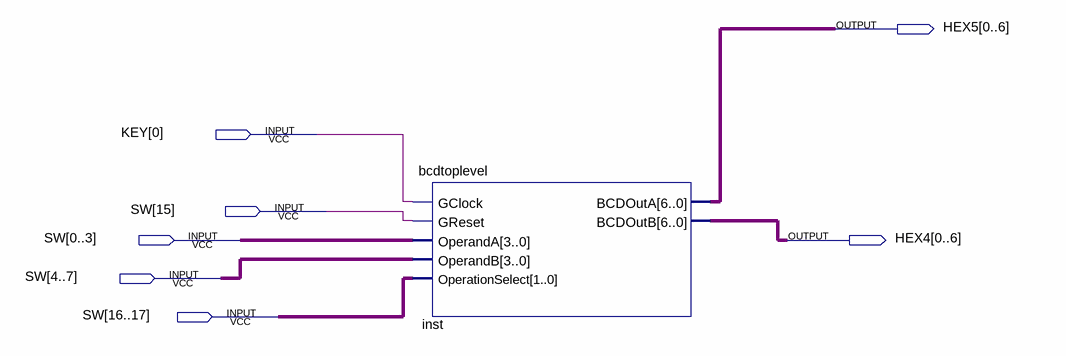
[diagram p0: schematic sheet]
// Quartus schematic CEG-3155-LAB-2.bdf as structural Verilog: 1 symbols, 7 pins
module \CEG-3155-LAB-2  (
  input  [0:0] KEY,
  input  [0:17] SW,
  output [0:6] HEX5,
  output [0:6] HEX4
);

  bcdtoplevel inst (
    .GClock(KEY[0]), .GReset(SW[15]), .OperandA(SW[0:3]), .OperandB(SW[4:7]), .OperationSelect(SW[16:17]),
    .BCDOutA(HEX5), .BCDOutB(HEX4));
endmodule
